# Altium schematic sheet HYDRA_V4_NAV.SchDoc
size C; SheetNumber: 1; SheetTotal: 9
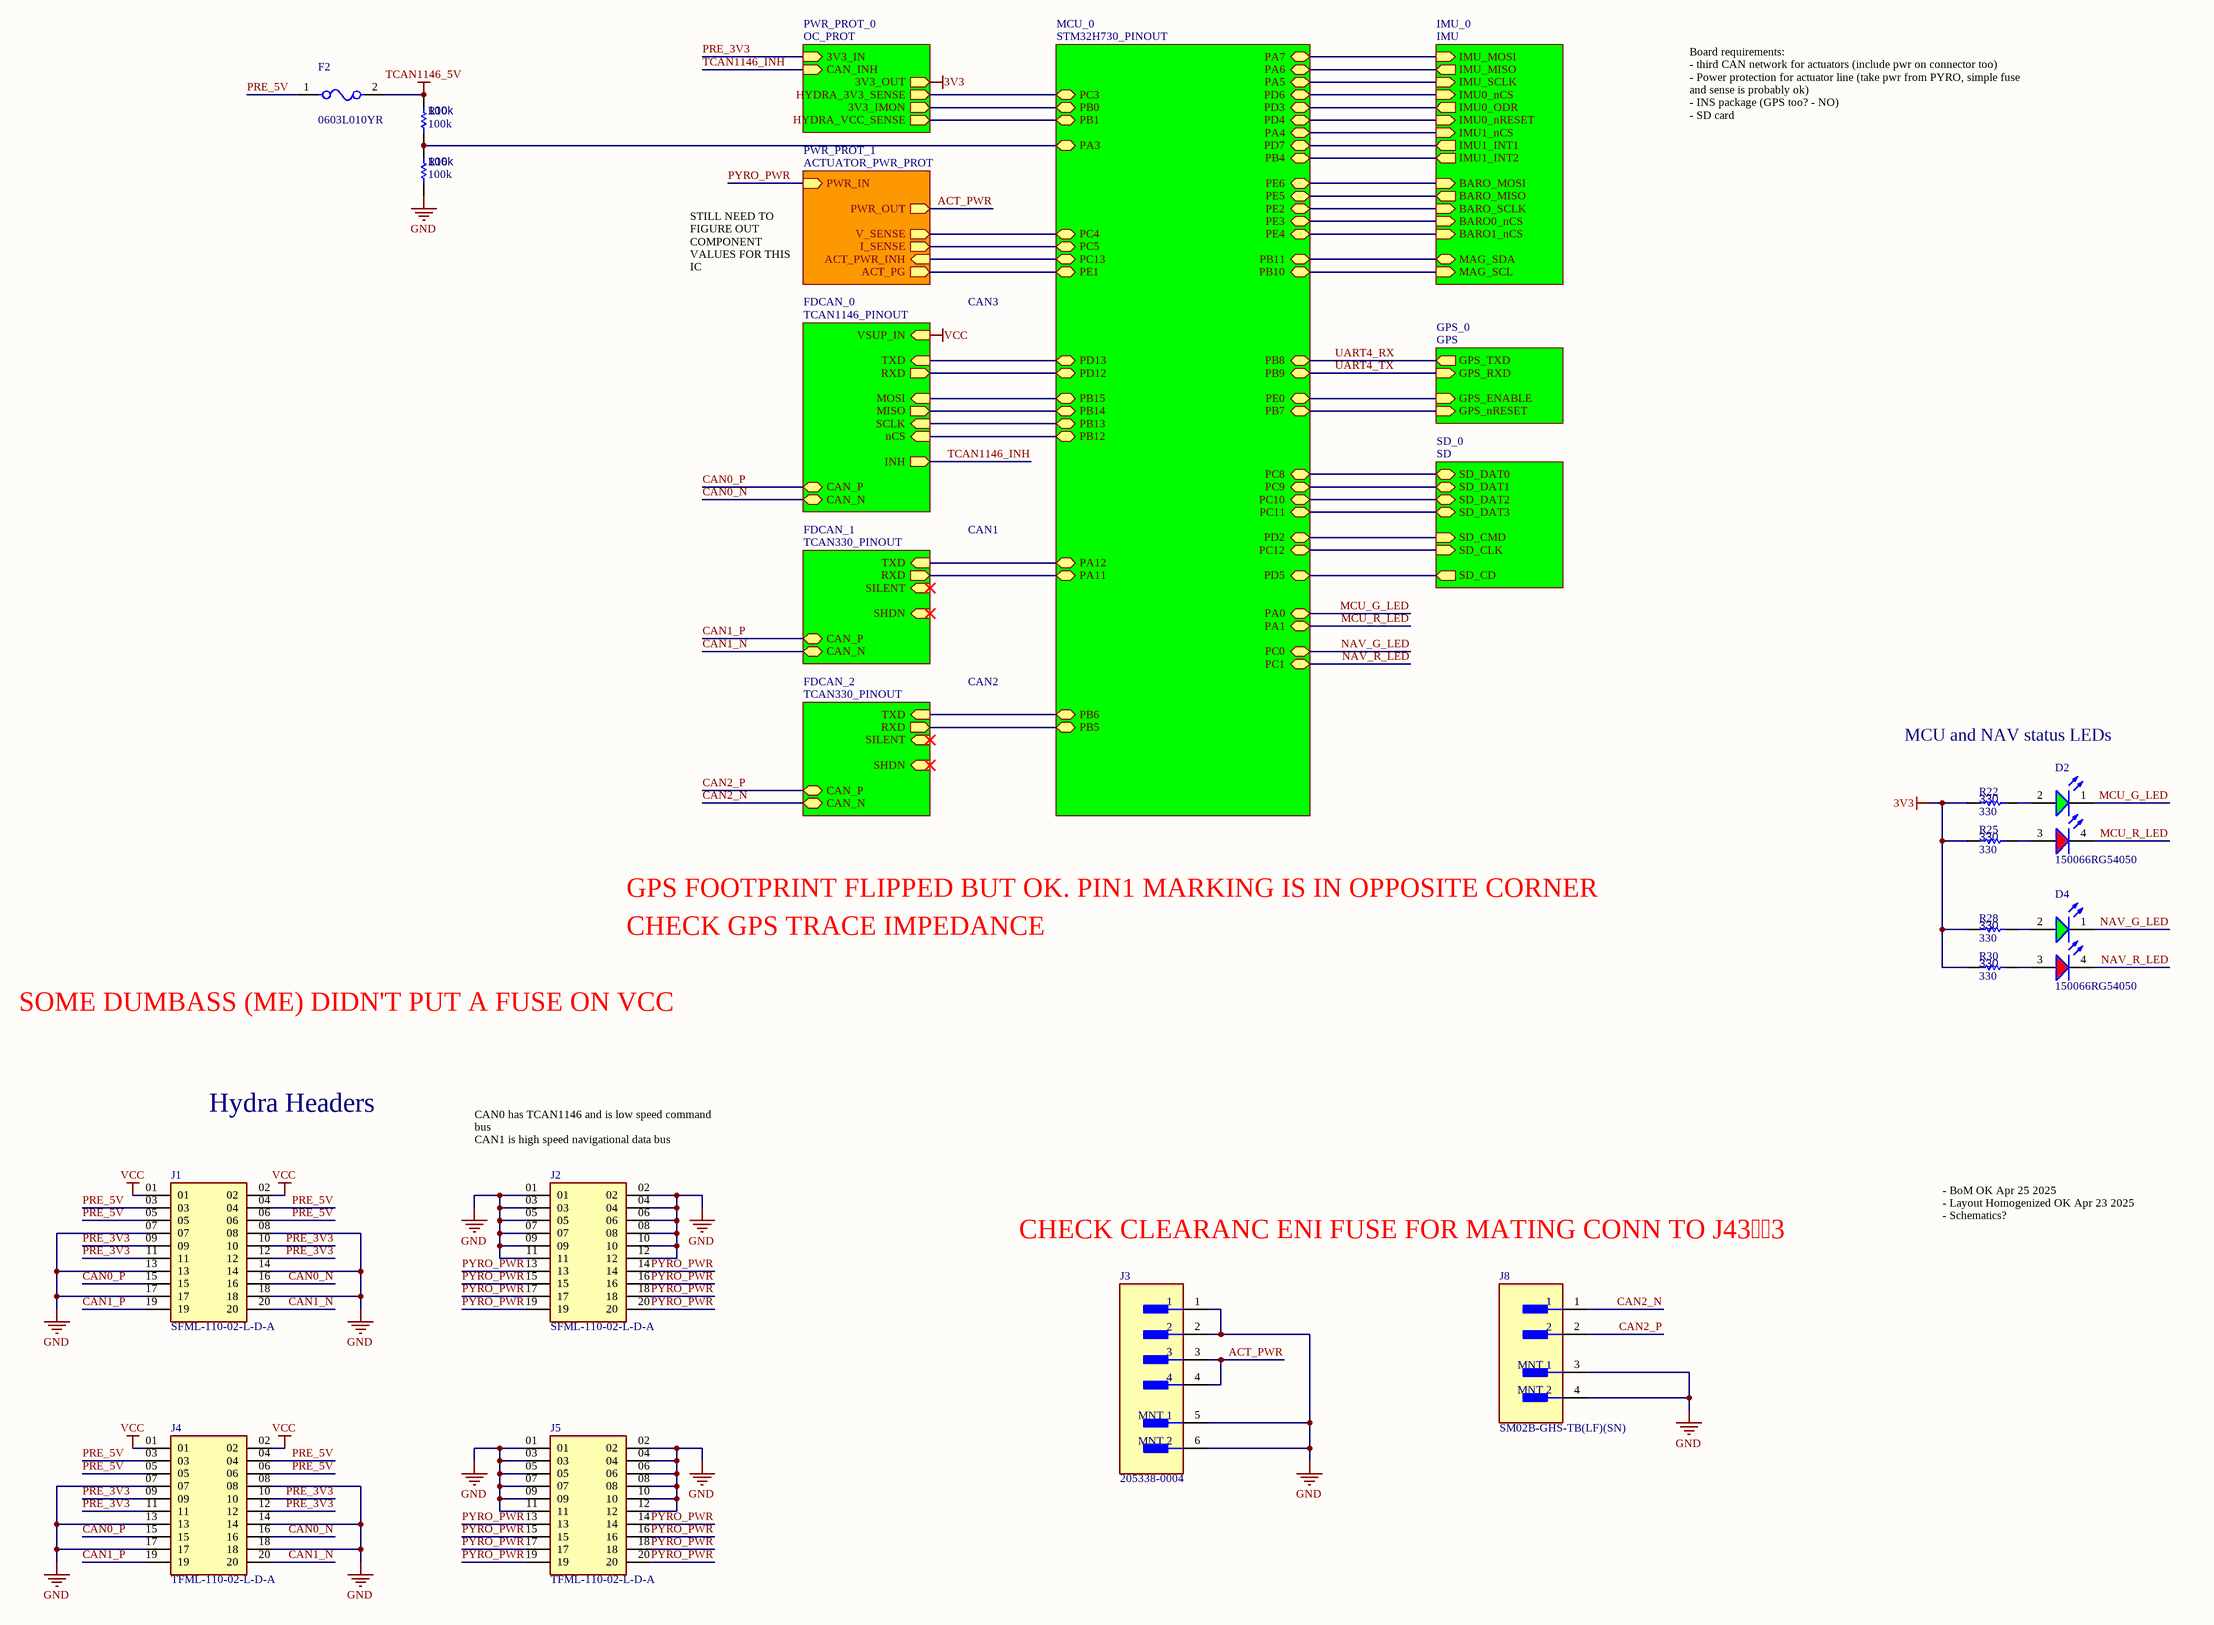
[diagram p0: HYDRA_V4_NAV.SchDoc]

## Parts
D2  150066RG54050  [WL-SBCD_0606]
D4  150066RG54050  [WL-SBCD_0606]
F2  0603L010YR  [FP-0603L-MFG]
J1  SFML-110-02-L-D-A  [SFML-110-02-L-D-A-Footprint-1]
J2  SFML-110-02-L-D-A  [SFML-110-02-L-D-A-Footprint-1]
J3  205338-0004  [FP-205338-0004-MFG]
J4  TFML-110-02-L-D-A  [TFML-110-02-L-D-A-Footprint-1]
J5  TFML-110-02-L-D-A  [TFML-110-02-L-D-A-Footprint-1]
J8  SM02B-GHS-TB(LF)(SN)  [FP-SM02B-GHS-TB_LF_SN-MFG]
R10  100k  [R0603B]
R16  100k  [R0603B]
R22  330  [R0603B]
R25  330  [R0603B]
R28  330  [R0603B]
R30  330  [R0603B]

## Sub-sheets
FDCAN_0 = TCAN1146_PINOUT: TXD (in), RXD (out), MOSI (in), MISO (out), SCLK (in), nCS (in), INH (out), CAN_P (bidir), CAN_N (bidir), VSUP_IN (in)
FDCAN_1 = TCAN330_PINOUT: TXD (in), RXD (out), SHDN (in), SILENT (in), CAN_P (bidir), CAN_N (bidir)
FDCAN_2 = TCAN330_PINOUT: TXD (in), RXD (out), SHDN (in), SILENT (in), CAN_P (bidir), CAN_N (bidir)
GPS_0 = GPS: GPS_TXD (out), GPS_RXD (in), GPS_ENABLE (in), GPS_nRESET (in)
IMU_0 = IMU: IMU0_nCS (in), IMU0_ODR (out), IMU0_nRESET (in), IMU1_nCS (in), IMU1_INT1 (out), IMU1_INT2 (out), BARO_MOSI (in), BARO_MISO (out), BARO_SCLK (in), BARO0_nCS (in), BARO1_nCS (in), IMU_MOSI (in), IMU_MISO (out), IMU_SCLK (in), MAG_SDA (bidir), MAG_SCL (in)
MCU_0 = STM32H730_PINOUT: PA5 (bidir), PA6 (bidir), PA7 (bidir), PA0 (bidir), PA1 (bidir), PA4 (bidir), PA12 (bidir), PA11 (bidir), PB4 (bidir), PB6 (bidir), PB5 (bidir), PB7 (bidir), PB9 (bidir), PB8 (bidir), PE0 (bidir), PE2 (bidir), PE3 (bidir), PE4 (bidir), PE5 (bidir), PE6 (bidir), PD7 (bidir), PD2 (bidir), PD3 (bidir), PD4 (bidir), PD5 (bidir), PD6 (bidir), PD12 (bidir), PD13 (bidir), PB12 (bidir), PB13 (bidir), PB14 (bidir), PB15 (bidir), PC0 (bidir), PC1 (bidir), PC8 (bidir), PC9 (bidir), PC10 (bidir), PC11 (bidir), PC12 (bidir), PC13 (bidir), PC4 (bidir), PC5 (bidir), PB0 (bidir), PB1 (bidir), PC3 (bidir), PB11 (bidir), PB10 (bidir), PA3 (bidir), PE1 (bidir)
PWR_PROT_0 = OC_PROT: 3V3_IN (in), 3V3_OUT (out), CAN_INH (in), 3V3_IMON (out), HYDRA_3V3_SENSE (out), HYDRA_VCC_SENSE (out)
PWR_PROT_1 = ACTUATOR_PWR_PROT: PWR_IN (in), PWR_OUT (out), V_SENSE (out), I_SENSE (out), ACT_PWR_INH (in), ACT_PG (out)
SD_0 = SD: SD_CD (out), SD_DAT0 (bidir), SD_DAT1 (bidir), SD_DAT2 (bidir), SD_DAT3 (bidir), SD_CMD (in), SD_CLK (in)

## Nets
3V3: R22.1 R25.1 R28.1 R30.1 ; sheet PWR_PROT_0/3V3_OUT
GND: J1.07 J1.08 J1.13 J1.14 J1.17 J1.18 J2.01 J2.02 J2.03 J2.04 J2.05 J2.06 J2.07 J2.08 J2.09 J2.10 J2.11 J2.12 J3.1 J3.2 J3.5(MNT_1) J3.6(MNT_2) J4.07 J4.08 J4.13 J4.14 J4.17 J4.18 J5.01 J5.02 J5.03 J5.04 J5.05 J5.06 J5.07 J5.08 J5.09 J5.10 J5.11 J5.12 J8.3(MNT_1) J8.4(MNT_2) R16.2
TCAN1146_5V: F2.2 R10.1
VCC: J1.01 J1.02 J4.01 J4.02 ; sheet FDCAN_0/VSUP_IN
ACT_PWR: J3.3 J3.4 ; sheet PWR_PROT_1/PWR_OUT
CAN0_N: J1.16 J4.16 ; sheet FDCAN_0/CAN_N
CAN0_P: J1.15 J4.15 ; sheet FDCAN_0/CAN_P
CAN1_N: J1.20 J4.20 ; sheet FDCAN_1/CAN_N
CAN1_P: J1.19 J4.19 ; sheet FDCAN_1/CAN_P
CAN2_N: J8.1 ; sheet FDCAN_2/CAN_N
CAN2_P: J8.2 ; sheet FDCAN_2/CAN_P
MCU_G_LED: D2.1(K) ; sheet MCU_0/PA0
MCU_R_LED: D2.4(K) ; sheet MCU_0/PA1
NAV_G_LED: D4.1(K) ; sheet MCU_0/PC0
NAV_R_LED: D4.4(K) ; sheet MCU_0/PC1
PRE_3V3: J1.09 J1.10 J1.11 J1.12 J4.09 J4.10 J4.11 J4.12 ; sheet PWR_PROT_0/3V3_IN
PRE_5V: F2.1 J1.03 J1.04 J1.05 J1.06 J4.03 J4.04 J4.05 J4.06
PYRO_PWR: J2.13 J2.14 J2.15 J2.16 J2.17 J2.18 J2.19 J2.20 J5.13 J5.14 J5.15 J5.16 J5.17 J5.18 J5.19 J5.20 ; sheet PWR_PROT_1/PWR_IN
TCAN1146_INH: sheet PWR_PROT_0/CAN_INH, sheet FDCAN_0/INH
UART4_RX: sheet MCU_0/PB8, sheet GPS_0/GPS_TXD
UART4_TX: sheet MCU_0/PB9, sheet GPS_0/GPS_RXD
NetD2_2: D2.2(A) R22.2
NetD2_3: D2.3(A) R25.2
NetD4_2: D4.2(A) R28.2
NetD4_3: D4.3(A) R30.2
NetR10_2: R10.2 R16.1 ; sheet MCU_0/PA3
(unnamed): sheet MCU_0/PA5, sheet IMU_0/IMU_SCLK
(unnamed): sheet MCU_0/PA6, sheet IMU_0/IMU_MISO
(unnamed): sheet MCU_0/PA7, sheet IMU_0/IMU_MOSI
(unnamed): sheet MCU_0/PA4, sheet IMU_0/IMU1_nCS
(unnamed): sheet MCU_0/PA12, sheet FDCAN_1/TXD
(unnamed): sheet MCU_0/PA11, sheet FDCAN_1/RXD
(unnamed): sheet MCU_0/PB4, sheet IMU_0/IMU1_INT2
(unnamed): sheet MCU_0/PB6, sheet FDCAN_2/TXD
(unnamed): sheet MCU_0/PB5, sheet FDCAN_2/RXD
(unnamed): sheet MCU_0/PB7, sheet GPS_0/GPS_nRESET
(unnamed): sheet MCU_0/PE0, sheet GPS_0/GPS_ENABLE
(unnamed): sheet MCU_0/PE2, sheet IMU_0/BARO_SCLK
(unnamed): sheet MCU_0/PE3, sheet IMU_0/BARO0_nCS
(unnamed): sheet MCU_0/PE4, sheet IMU_0/BARO1_nCS
(unnamed): sheet MCU_0/PE5, sheet IMU_0/BARO_MISO
(unnamed): sheet MCU_0/PE6, sheet IMU_0/BARO_MOSI
(unnamed): sheet MCU_0/PD7, sheet IMU_0/IMU1_INT1
(unnamed): sheet MCU_0/PD2, sheet SD_0/SD_CMD
(unnamed): sheet MCU_0/PD3, sheet IMU_0/IMU0_ODR
(unnamed): sheet MCU_0/PD4, sheet IMU_0/IMU0_nRESET
(unnamed): sheet MCU_0/PD5, sheet SD_0/SD_CD
(unnamed): sheet MCU_0/PD6, sheet IMU_0/IMU0_nCS
(unnamed): sheet MCU_0/PD12, sheet FDCAN_0/RXD
(unnamed): sheet MCU_0/PD13, sheet FDCAN_0/TXD
(unnamed): sheet MCU_0/PB12, sheet FDCAN_0/nCS
(unnamed): sheet MCU_0/PB13, sheet FDCAN_0/SCLK
(unnamed): sheet MCU_0/PB14, sheet FDCAN_0/MISO
(unnamed): sheet MCU_0/PB15, sheet FDCAN_0/MOSI
(unnamed): sheet MCU_0/PC8, sheet SD_0/SD_DAT0
(unnamed): sheet MCU_0/PC9, sheet SD_0/SD_DAT1
(unnamed): sheet MCU_0/PC10, sheet SD_0/SD_DAT2
(unnamed): sheet MCU_0/PC11, sheet SD_0/SD_DAT3
(unnamed): sheet MCU_0/PC12, sheet SD_0/SD_CLK
(unnamed): sheet MCU_0/PC13, sheet PWR_PROT_1/ACT_PWR_INH
(unnamed): sheet MCU_0/PC4, sheet PWR_PROT_1/V_SENSE
(unnamed): sheet MCU_0/PC5, sheet PWR_PROT_1/I_SENSE
(unnamed): sheet MCU_0/PB0, sheet PWR_PROT_0/3V3_IMON
(unnamed): sheet MCU_0/PB1, sheet PWR_PROT_0/HYDRA_VCC_SENSE
(unnamed): sheet MCU_0/PC3, sheet PWR_PROT_0/HYDRA_3V3_SENSE
(unnamed): sheet MCU_0/PB11, sheet IMU_0/MAG_SDA
(unnamed): sheet MCU_0/PB10, sheet IMU_0/MAG_SCL
(unnamed): sheet MCU_0/PE1, sheet PWR_PROT_1/ACT_PG

## Notes on the sheet
- STILL NEED TO FIGURE OUT COMPONENT VALUES FOR THIS IC
- CAN3
- Board requirements:
  - third CAN network for actuators (include pwr on connector too)
  - Power protection for actuator line (take pwr from PYRO, simple fuse and sense is probably ok)
  - INS package (GPS too? - NO)
  - SD card
- CAN1
- CAN2
- MCU and NAV status LEDs
- GPS FOOTPRINT FLIPPED BUT OK. PIN1 MARKING IS IN OPPOSITE CORNER
- CHECK GPS TRACE IMPEDANCE
- SOME DUMBASS (ME) DIDN'T PUT A FUSE ON VCC
- Hydra Headers
- CAN0 has TCAN1146 and is low speed command bus
  CAN1 is high speed navigational data bus
  CAN2 is high speed actuator data bus
- CHECK CLEARANC ENI FUSE FOR MATING CONN TO J433
- - BoM OK Apr 25 2025
  - Layout Homogenized OK Apr 23 2025
  - Schematics?

## Library data of the parts
D2 D4 = CMP-004-00040-2: Led, Red/Grn, 180Mcd/230Mcd, 624Nm/525Nm Rohs Compliant: Yes; Source: rgled.SchLib; Component Type: Standard; Design Item ID: CMP-004-00034-2; Pins: 4
F2 = CMP-08606-000025-1: PTC RESET FUSE 15V 100MA 0603; Manufacturer: Littelfuse Inc; Value: 0.9-6Ω; Trip Time: 1s; Current Rating: 40A; Trip Current: 0.3A; Hold Current: 0.1A; Octopart: https://octopart.com/0603l010yr-littelfuse-8316166; ComponentLink2URL: https://www.littelfuse.com/~/media/electronics/datasheets/resettable_ptcs/littelfuse_ptc_0603l_datasheet.pdf.pdf; Package: 0603L; Category: Fuse; Mouser Description: Resettable Fuses - PPTC PTC 15V 0603 .100A POLY SURF MOUNT; Automotive: No; Resistance: 0.9-6Ω; Device Class L3: unset; Digikey Description: PTC RESET FUSE 15V 100MA 0603; Lead Free: Yes; Temperature: -40°C to +85°C; Ambient Temperature Range High: +85°C; ComponentLink2Description: Datasheet; RoHS: TRUE; Height: 0.75mm; Temperature Range Low: -40°C; Manufacturer Part Number: 0603L010YR; Device Class L2: PTC Resettable Fuses; Device Class L1: Circuit Protection; Temperature Range High: +85°C; Ambient Temperature Range Low: -40°C; Voltage Rating: 15V
J1 J2 = CMP-002-00043-1: Board Connector, 20 Contact(s), 2 Row(s), Female, Straight, 0.05 inch Pitch, Surface Mount Terminal, Locking, Black Insulator, Socket; RoHS Compliant: Yes; Connector Type: BOARD CONNECTOR; Mounting Technology: Board
J3 = CMP-04776-000717-1: PICO-LOCK 2.0 W/B HEADER ASSY ET
J4 J5 = CMP-002-00042-3: Board Connector, 20 Contact(s), 2 Row(s), Male, Straight, Surface Mount Terminal; Connector Type: BOARD CONNECTOR; Mounting Technology: Board; RoHS Compliant: Yes
J8 = CMP-002-00083-1: MCU 32-bit LPC1800 ARM Cortex M3 RISC 768KB Flash 3.3V 100-Pin TFBGA Tray
R10 R16 R22 R25 R28 R30 = CMP-009-00002-14: Resistor
  R10 R16: Value: 100k
  R22 R25 R28 R30: Value: 330